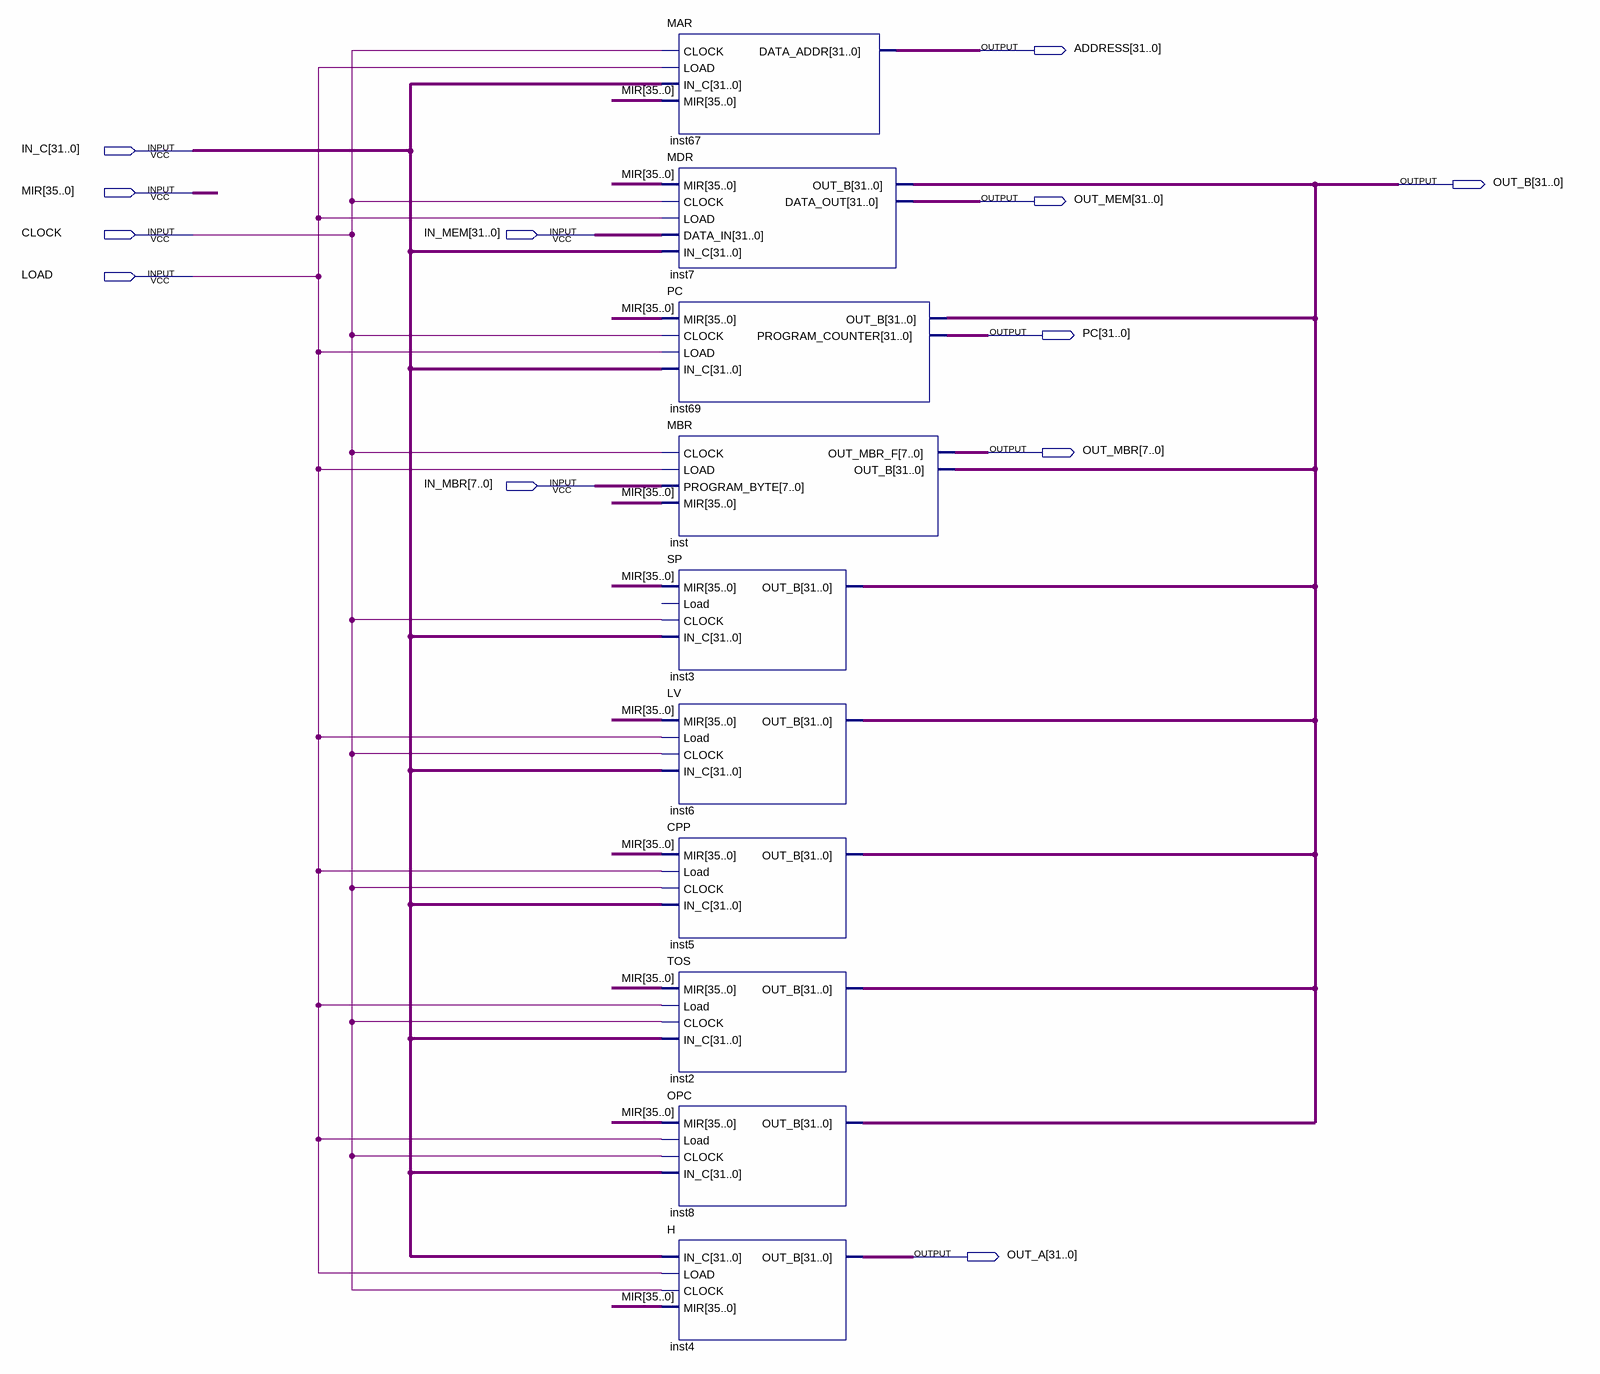
[diagram p0: schematic sheet]
// Quartus schematic BANK_REGS.bdf as structural Verilog: 10 symbols, 12 pins
module BANK_REGS (
  input  [31:0] IN_C,
  input  [35:0] MIR,
  input  CLOCK,
  input  [31:0] IN_MEM,
  input  LOAD,
  input  [7:0] IN_MBR,
  output [31:0] ADDRESS,
  output [31:0] OUT_B,
  output [31:0] OUT_MEM,
  output [31:0] PC,
  output [7:0] OUT_MBR,
  output [31:0] OUT_A
);

  MAR inst67 (.CLOCK(CLOCK), .LOAD(LOAD), .IN_C(IN_C), .MIR(MIR), .DATA_ADDR(ADDRESS));
  MDR inst7 (.MIR(MIR), .CLOCK(CLOCK), .LOAD(LOAD), .DATA_IN(IN_MEM), .IN_C(IN_C), .OUT_B(OUT_B), .DATA_OUT(OUT_MEM));
  PC inst69 (.MIR(MIR), .CLOCK(CLOCK), .LOAD(LOAD), .IN_C(IN_C), .OUT_B(OUT_B), .PROGRAM_COUNTER(PC));
  MBR inst (.CLOCK(CLOCK), .LOAD(LOAD), .PROGRAM_BYTE(IN_MBR), .MIR(MIR), .OUT_MBR_F(OUT_MBR), .OUT_B(OUT_B));
  SP inst3 (.MIR(MIR), .CLOCK(CLOCK), .IN_C(IN_C), .OUT_B(OUT_B));  // open: Load
  LV inst6 (.MIR(MIR), .Load(LOAD), .CLOCK(CLOCK), .IN_C(IN_C), .OUT_B(OUT_B));
  CPP inst5 (.MIR(MIR), .Load(LOAD), .CLOCK(CLOCK), .IN_C(IN_C), .OUT_B(OUT_B));
  TOS inst2 (.MIR(MIR), .Load(LOAD), .CLOCK(CLOCK), .IN_C(IN_C), .OUT_B(OUT_B));
  OPC inst8 (.MIR(MIR), .Load(LOAD), .CLOCK(CLOCK), .IN_C(IN_C), .OUT_B(OUT_B));
  H inst4 (.IN_C(IN_C), .LOAD(LOAD), .CLOCK(CLOCK), .MIR(MIR), .OUT_B(OUT_A));
endmodule
